# EAGLE design clock_rev0 (EAGLE 8.2.0)
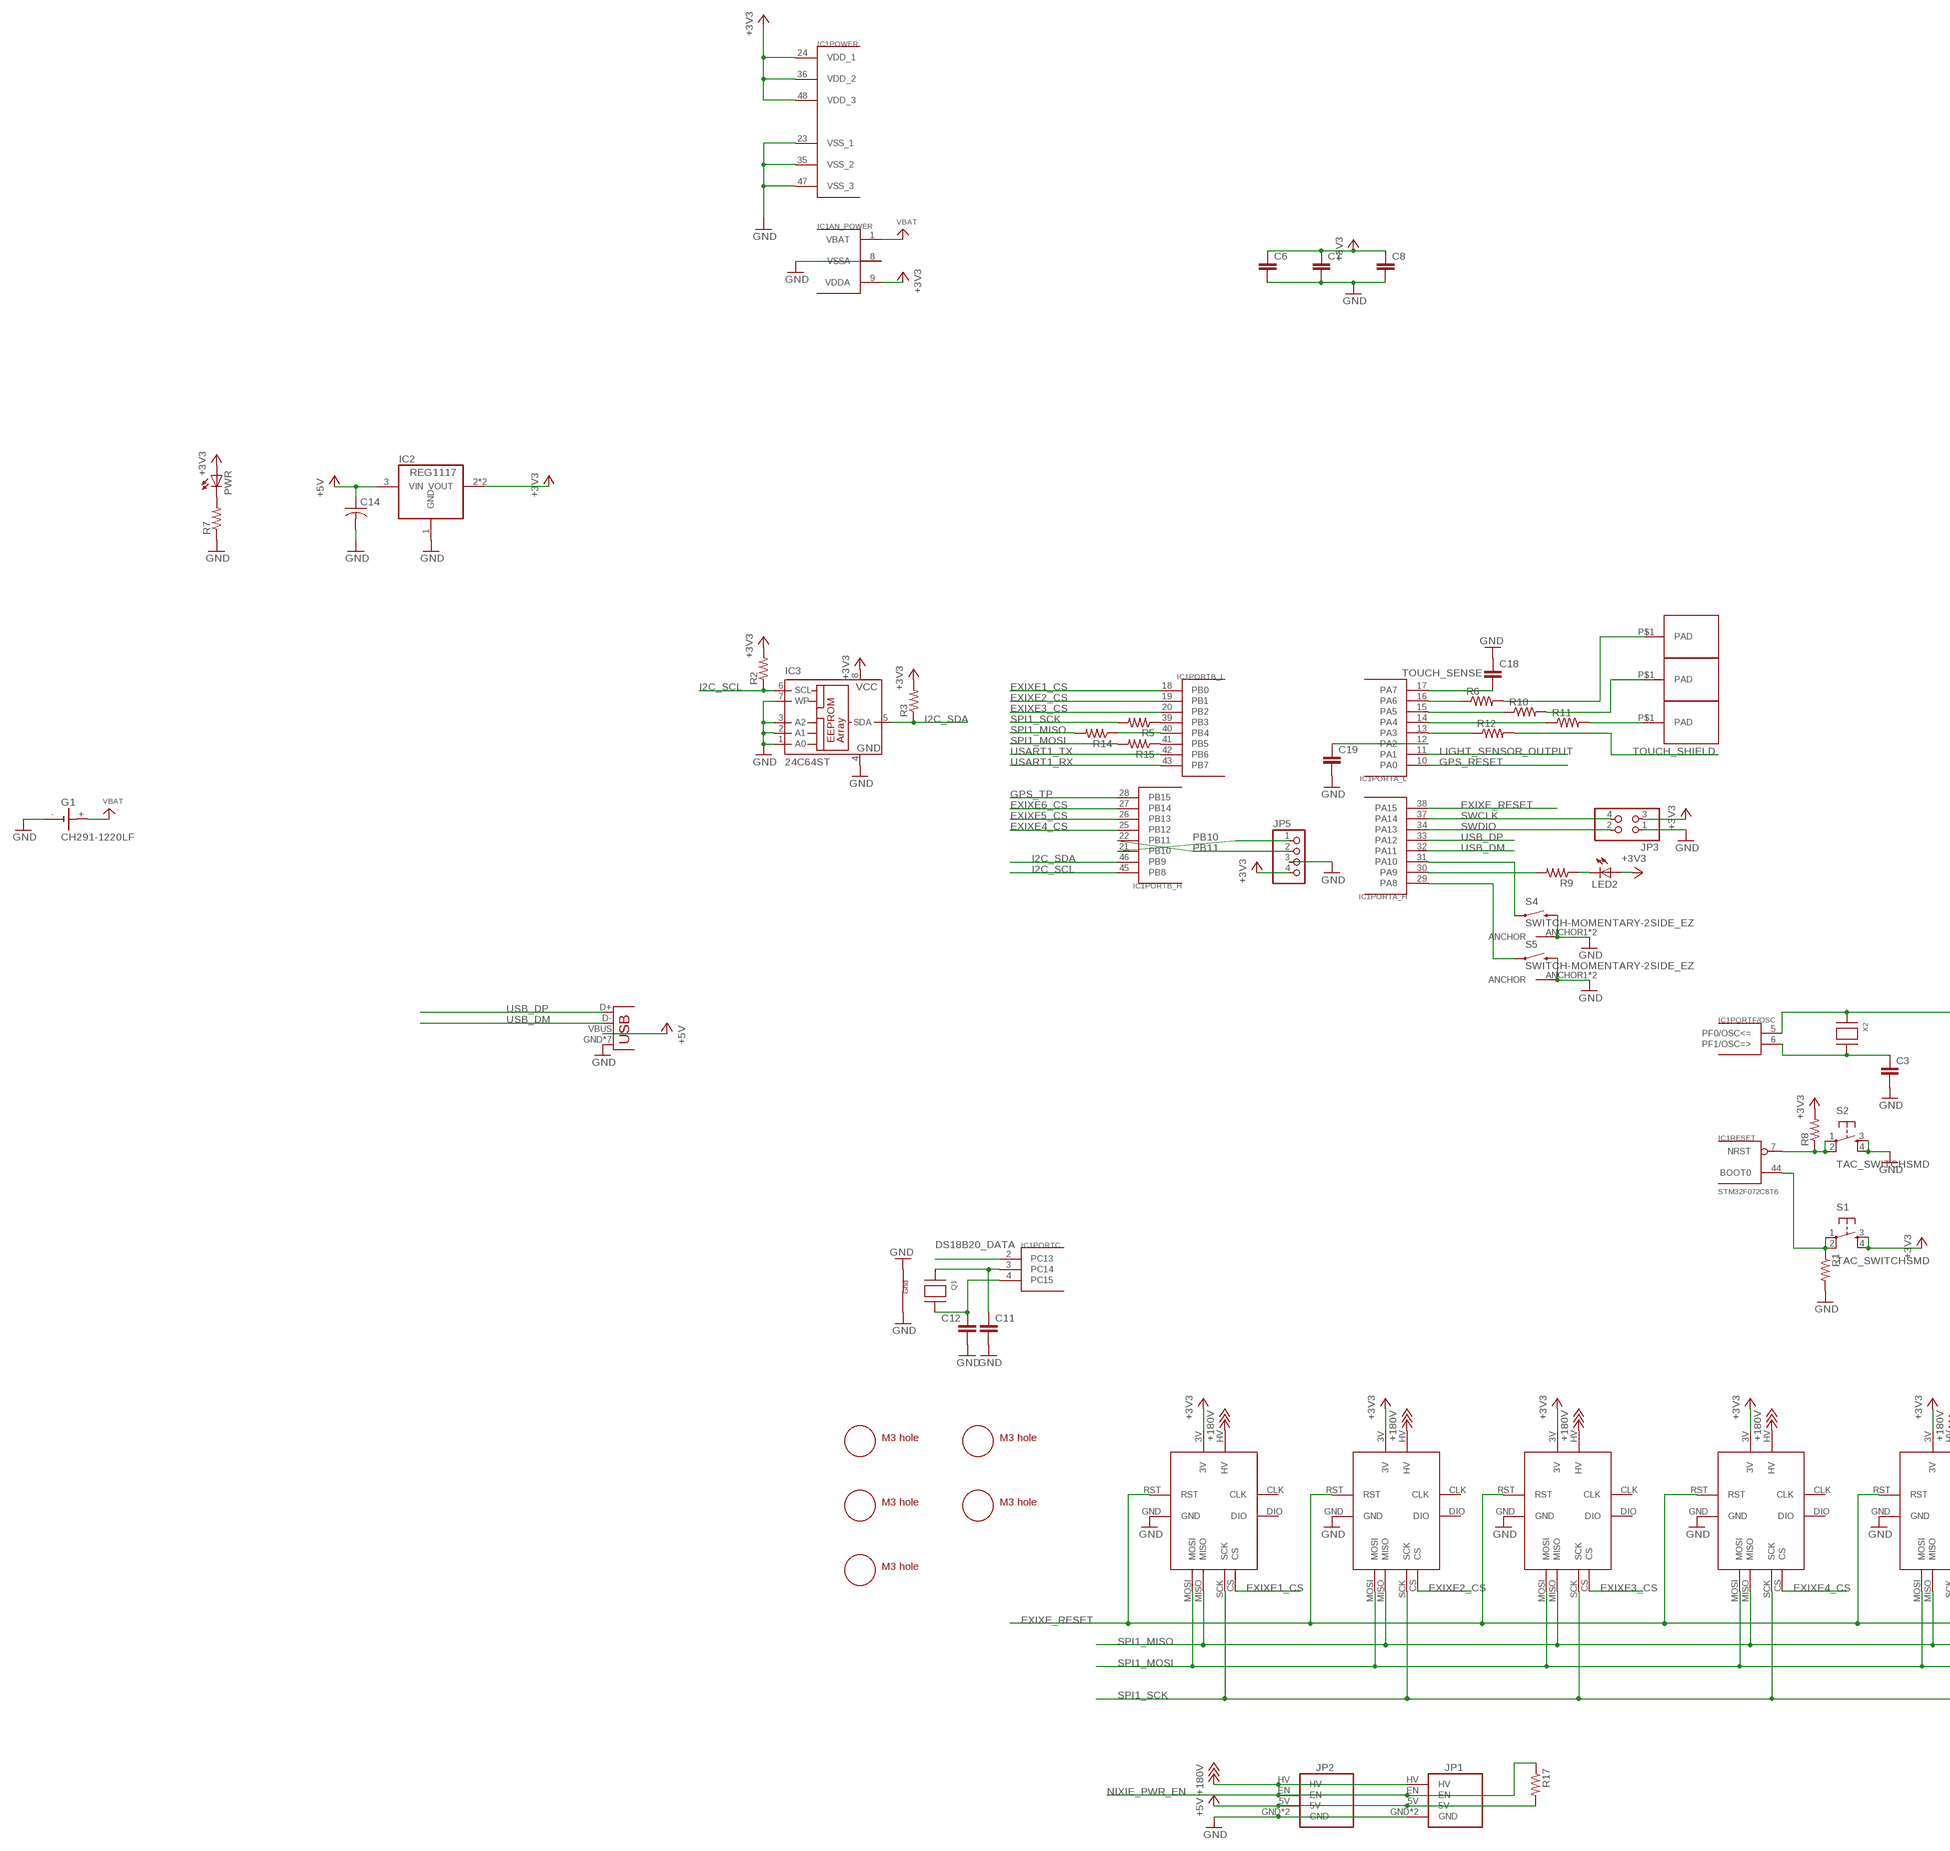
[diagram p0: schematic, sheet 1, part 1 of 2]
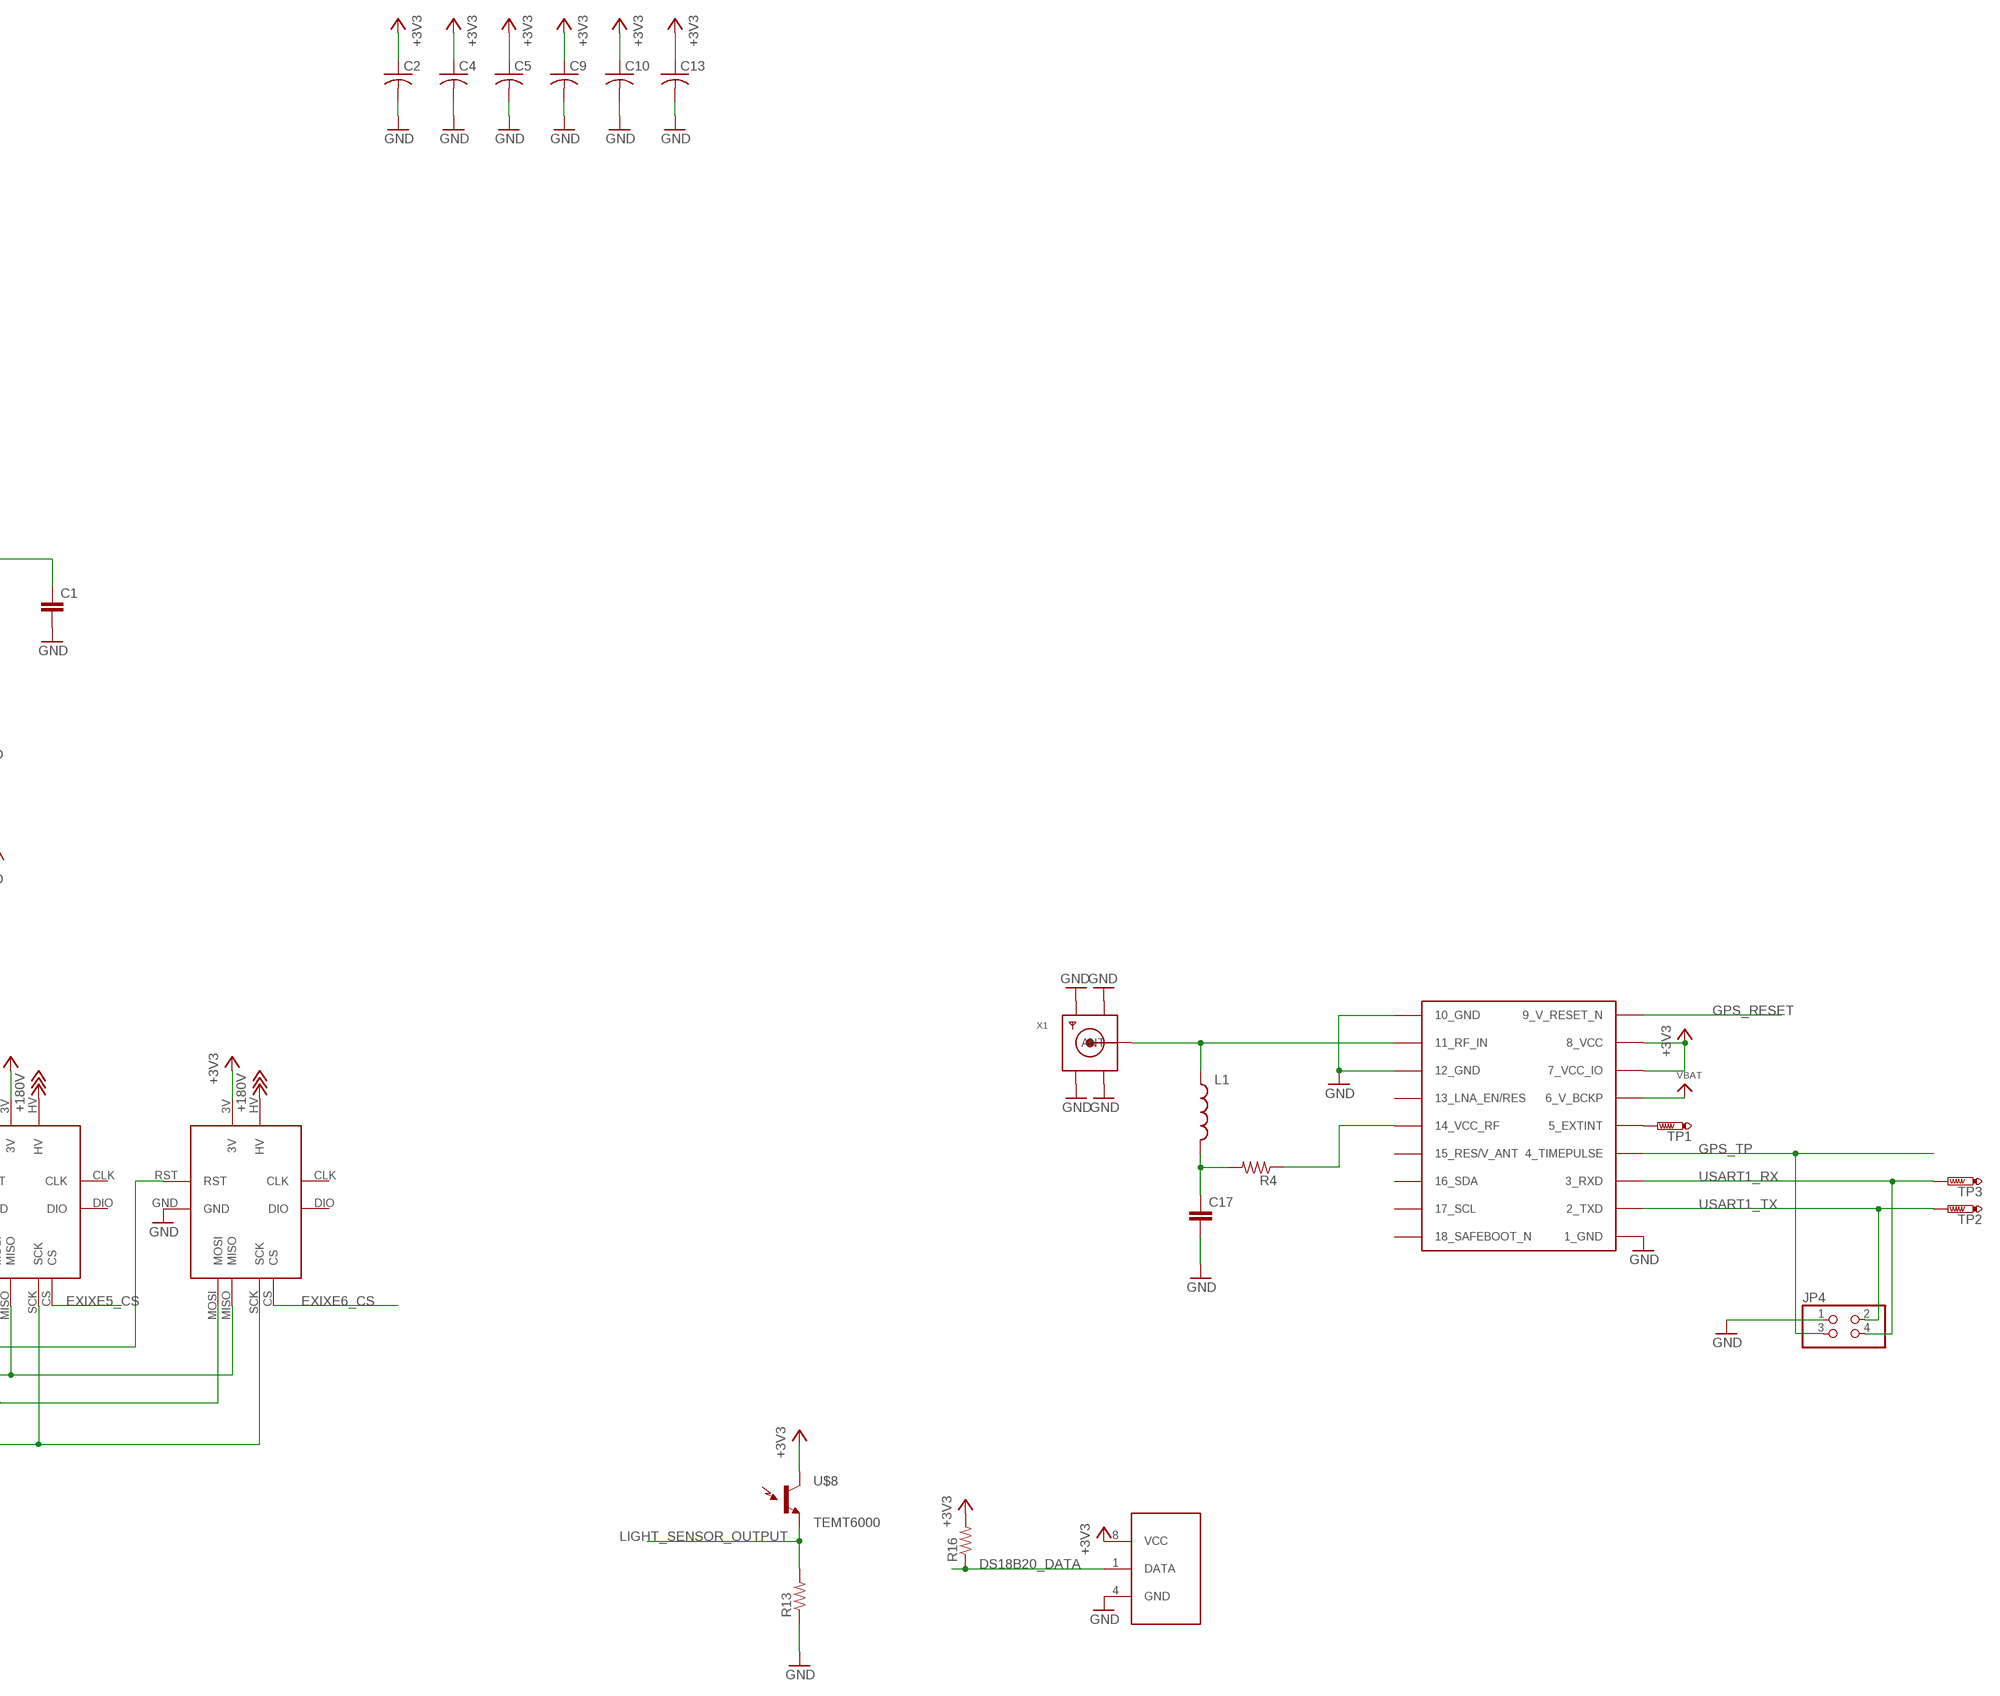
[diagram p1: schematic, sheet 1, part 2 of 2]

## Parts
C1  CAP0805  [0805]
C2  C-USC1210  [C1210]
C3  CAP0805  [0805]
C4  C-USC1210  [C1210]
C5  C-USC1210  [C1210]
C6  CAP0805  [0805]
C7  CAP0805  [0805]
C8  CAP0805  [0805]
C9  C-USC1210  [C1210]
C10  C-USC1210  [C1210]
C11  CAP0805  [0805]
C12  CAP0805  [0805]
C13  C-USC1210  [C1210]
C14  C-USC1210  [C1210]
C17  CAP0805  [0805]
C18  CAP0805  [0805]
C19  CAP0805  [0805]
G1  CH291-1220LF  [CH291-1220LF]
IC1  STM32F072C8T6  [TQFP48]
IC2  REG1117  [SOT223]
IC3  24C64ST  [TSSOP8]
JP1  EBAY_MODULEEBAY  [EBAY_PKG]
JP2  EBAY_MODULETAOBAO  [TAOBAO_PKG]
JP3  PINHD-2X2  [2X02]
JP4  PINHD-2X2  [2X02]
JP5  PINHD-1X4  [1X04]
L1  INDUCTOR0805  [0805]
LED2  LEDCHIP-LED0805  [CHIP-LED0805]
PWR  LEDCHIP-LED0805  [CHIP-LED0805]
Q1  XTAL-4-3225  [NX3225]
R1  RESISTOR0805-RES  [0805]
R2  RESISTOR0805-RES  [0805]
R3  RESISTOR0805-RES  [0805]
R4  RESISTOR0805-RES  [0805]
R5  RESISTOR0805-RES  [0805]
R6  RESISTOR0805-RES  [0805]
R7  RESISTOR0805-RES  [0805]
R8  RESISTOR0805-RES  [0805]
R9  RESISTOR0805-RES  [0805]
R10  RESISTOR0805-RES  [0805]
R11  RESISTOR0805-RES  [0805]
R12  RESISTOR0805-RES  [0805]
R13  RESISTOR0805-RES  [0805]
R14  RESISTOR0805-RES  [0805]
R15  RESISTOR0805-RES  [0805]
R16  RESISTOR0805-RES  [0805]
R17  RESISTOR0805-RES  [0805]
S1  TAC_SWITCHSMD  [TACTILE-SWITCH-SMD]
S2  TAC_SWITCHSMD  [TACTILE-SWITCH-SMD]
S4  SWITCH-MOMENTARY-2SIDE_EZ  [TACTILE-PTH-SIDEEZ]
S5  SWITCH-MOMENTARY-2SIDE_EZ  [TACTILE-PTH-SIDEEZ]
TP1  PTR1TP20R  [TP20R]
TP2  PTR1TP20R  [TP20R]
TP3  PTR1TP20R  [TP20R]
U$1  EXIXE  [EXIXE_PAC]
U$2  EXIXE  [EXIXE_PAC]
U$3  EXIXE  [EXIXE_PAC]
U$4  EXIXE  [EXIXE_PAC]
U$5  EXIXE  [EXIXE_PAC]
U$6  EXIXE  [EXIXE_PAC]
U$7  MAX-M8  [MAX-M8]
U$8  TEMT6000  [TEMT6000-SEN]
U$9  DS18B20  [MSOP8]
U$10  M3_MOUNTING_HOLE  [M3_MOUNTING_HOLE_PACK]
U$11  M3_MOUNTING_HOLE  [M3_MOUNTING_HOLE_PACK]
U$12  M3_MOUNTING_HOLE  [M3_MOUNTING_HOLE_PACK]
U$13  M3_MOUNTING_HOLE  [M3_MOUNTING_HOLE_PACK]
U$14  TOUCHPAD  [TOUCHPAD_PAK]
U$15  TOUCHPAD  [TOUCHPAD_PAK]
U$16  TOUCHPAD  [TOUCHPAD_PAK]
U$20  M3_MOUNTING_HOLE  [M3_MOUNTING_HOLE_PACK]
X1  SMACONNECTOR  [SMA90_DIP]
X2  XTAL-3.2X1.5  [XTAL3215]
X3  USB-MICROB  [USB-MICROB]

## Nets
+3V3: C2.1 C4.1 C5.1 C6.1 C7.1 C8.1 C9.1 C10.1 C13.1 IC1.9(AN_POWER:VDDA) IC1.24(POWER:VDD_1) IC1.36(POWER:VDD_2) IC1.48(POWER:VDD_3) IC2.2(VOUT) IC2.4(VOUT) IC3.8(VCC) JP3.3 JP5.4 LED2.A PWR.A R2.2 R3.2 R8.2 R16.2 S1.3 S1.4 U$1.3V U$2.3V U$3.3V U$4.3V U$5.3V U$6.3V U$7.7_VCC_IO U$7.8_VCC U$8.COLLECTOR(C1) U$9.8(VCC)
+5V: C14.1 IC2.3(VIN) JP1.5V JP2.5V R17.2 X3.VBUS
+180V: JP1.HV JP2.HV U$1.HV U$2.HV U$3.HV U$4.HV U$5.HV U$6.HV
DS18B20_DATA: IC1.2(PORTC:PC13) R16.1 U$9.1(DATA)
EXIXE1_CS: IC1.18(PORTB_L:PB0) U$1.CS
EXIXE2_CS: IC1.19(PORTB_L:PB1) U$2.CS
EXIXE3_CS: IC1.20(PORTB_L:PB2) U$3.CS
EXIXE4_CS: IC1.25(PORTB_H:PB12) U$4.CS
EXIXE5_CS: IC1.26(PORTB_H:PB13) U$5.CS
EXIXE6_CS: IC1.27(PORTB_H:PB14) U$6.CS
EXIXE_RESET: IC1.38(PORTA_H:PA15) U$1.RST U$2.RST U$3.RST U$4.RST U$5.RST U$6.RST
GND: C1.2 C2.2 C3.2 C4.2 C5.2 C6.2 C7.2 C8.2 C9.2 C10.2 C11.2 C12.2 C13.2 C14.2 C17.2 C18.1 C19.2 G1.- IC1.8(AN_POWER:VSSA) IC1.23(POWER:VSS_1) IC1.35(POWER:VSS_2) IC1.47(POWER:VSS_3) IC2.1(GND) IC3.1(A0) IC3.2(A1) IC3.3(A2) IC3.4(GND) IC3.7(WP) JP1.GND JP1.GND2(GND) JP2.GND JP2.GND2(GND) JP3.1 JP4.1 JP5.3 Q1.2(G2) Q1.4(G1) R1.2 R7.1 R13.1 S2.3 S2.4 S4.2 S4.ANCHOR1(ANCHOR) S4.ANCHOR2(ANCHOR) S5.2 S5.ANCHOR1(ANCHOR) S5.ANCHOR2(ANCHOR) U$1.GND U$2.GND U$3.GND U$4.GND U$5.GND U$6.GND U$7.1_GND U$7.10_GND U$7.12_GND U$9.4(GND) X1.GND1 X1.GND2 X1.GND3 X1.GND4 X3.GND X3.P1(GND) X3.P2(GND) X3.P3(GND) X3.P4(GND) X3.P5(GND) X3.P6(GND)
GPS_RESET: IC1.10(PORTA_L:PA0) U$7.9_RESET_N(9_V_RESET_N)
GPS_TP: IC1.28(PORTB_H:PB15) JP4.3 U$7.4_TIMEPULSE
I2C_SCL: IC1.45(PORTB_H:PB8) IC3.6(SCL) R2.1
I2C_SDA: IC1.46(PORTB_H:PB9) IC3.5(SDA) R3.1
LIGHT_SENSOR_OUTPUT: IC1.11(PORTA_L:PA1) R13.2 U$8.EMITTER(E1)
N$1: C11.1 IC1.3(PORTC:PC14) Q1.1(X1)
N$2: C12.1 IC1.4(PORTC:PC15) Q1.3(X2)
N$3: IC1.7(RESET:NRST) R8.1 S2.1 S2.2
N$4: L1.1 U$7.11_RF_IN X1.ANTENNA(ANT)
N$5: IC1.44(RESET:BOOT0) R1.1 S1.1 S1.2
N$6: C3.1 IC1.6(PORTF/OSC:PF1/OSC=>) X2.P$2
N$7: C1.1 IC1.5(PORTF/OSC:PF0/OSC<=) X2.P$1
N$8: IC1.14(PORTA_L:PA4) R11.1
N$9: R10.2 U$15.P$1(PAD)
N$10: R6.2 U$16.P$1(PAD)
N$11: IC1.13(PORTA_L:PA3) R12.1
N$12: C17.1 L1.2 R4.2
N$13: R4.1 U$7.14_VCC_RF
N$14: R11.2 U$14.P$1(PAD)
N$15: IC1.15(PORTA_L:PA5) R10.1
N$16: IC1.16(PORTA_L:PA6) R6.1
N$17: IC1.39(PORTB_L:PB3) R5.1
N$18: C19.1 IC1.12(PORTA_L:PA2)
N$19: IC1.41(PORTB_L:PB5) R15.1
N$20: IC1.40(PORTB_L:PB4) R14.1
N$21: LED2.C R9.1
N$22: IC1.31(PORTA_H:PA10) S4.1
N$23: IC1.29(PORTA_H:PA8) S5.1
N$24: IC1.30(PORTA_H:PA9) R9.2
N$25: TP1.TP U$7.5_EXTINT
N$27: PWR.C R7.2
NIXIE_PWR_EN: JP1.EN JP2.EN R17.1
PB10: IC1.21(PORTB_H:PB10) JP5.1
PB11: IC1.22(PORTB_H:PB11) JP5.2
SPI1_MISO: R14.2 U$1.MISO U$2.MISO U$3.MISO U$4.MISO U$5.MISO U$6.MISO
SPI1_MOSI: R15.2 U$1.MOSI U$2.MOSI U$3.MOSI U$4.MOSI U$5.MOSI U$6.MOSI
SPI1_SCK: R5.2 U$1.SCK U$2.SCK U$3.SCK U$4.SCK U$5.SCK U$6.SCK
SWCLK: IC1.37(PORTA_H:PA14) JP3.4
SWDIO: IC1.34(PORTA_H:PA13) JP3.2
TOUCH_SENSE: C18.2 IC1.17(PORTA_L:PA7)
TOUCH_SHIELD: R12.2
USART1_RX: IC1.43(PORTB_L:PB7) JP4.4 TP3.TP U$7.3_RXD
USART1_TX: IC1.42(PORTB_L:PB6) JP4.2 TP2.TP U$7.2_TXD
USB_DM: IC1.32(PORTA_H:PA11) X3.D-
USB_DP: IC1.33(PORTA_H:PA12) X3.D+
VBAT: G1.+ IC1.1(AN_POWER:VBAT) U$7.6_V_BCKP
Unconnected: U$1.CLK U$1.DIO U$2.CLK U$2.DIO U$3.CLK U$3.DIO U$4.CLK U$4.DIO U$5.CLK U$5.DIO U$6.CLK U$6.DIO U$7.13_LNA_EN(13_LNA_EN/RES) U$7.15_V_ANT/RESERVED(15_RES/V_ANT) U$7.16_SDA U$7.17_SCL U$7.18_SAFEBOOT_N

## Library data of the parts
C1 C3 C6-C8 C11 C12 C17-C19 = clock:CAP: Capacitor Standard 0603 ceramic capacitor, and 0.1" leaded capacitor.
C2 C4 C5 C9 C10 C13 C14 = clock:C-US: CAPACITOR, American symbol
G1 = basicBoard:CH291-1220LF: Battery Holder, SMT, 12mm multicomp PART NO. CH291-1220LF Source: Data sheet <http://www.farnell.com/datasheets/1505860.pdf>
IC1 = joyAnalog:STM32F072C8T6: ST STM32F072 48pin LQFP
IC2 = clock:REG1117: 800mA and 1A Low Dropout (LDO) Positive Regulator 1.8V, 2.5V, 2.85V, 3.3V, 5V, and Adj; MPN: REG1117; OC_FARNELL: 1097566; OC_NEWARK: 14P6981
IC3 = microchip:24*: Serial EEPROM I2C; MPN: CAT24C64YI-GT3; OC_FARNELL: 1718133; OC_NEWARK: 08R5418
JP1 JP2 = nixie_power:EBAY_MODULE: PIN HEADER
JP3 JP4 = pinhead:PINHD-2X2: PIN HEADER
JP5 = pinhead:PINHD-1X4: PIN HEADER
L1 = basicBoard:INDUCTOR: Inductors Basic Inductor/Choke - 0603 and 1206. Footprints are not proven and vary greatly between part numbers. INDUCTOR POWER 3.3UH 4.0A SMD 0.197" L x 0.197" W x 0.177" H (5.00mm x 5.00mm x 4.50mm)
LED2 PWR = backplane:LED: LED OSRAM: - CHIPLED LG R971, LG N971, LY N971, LG Q971, LY Q971, LO R971, LY R971 LH N974, LH R974 LS Q976, LO Q976, LY Q976 LO Q996 - Hyper CHIPLED LW Q18S LB Q993, LB Q99A, LB R99A - SideLED LS A670, LO A670, LY A670, LG A670, LP A670 LB A673, LV A673, LT A673, LW A673 LH A674 LY A675 LS A676, LA A676, LO A676, LY A676, LW A676 LS A679, LY A679, LG A679 - Hyper Micro SIDELED® LS Y876, LA Y876, LO Y876, LY Y876 LT Y87S - SmartLED LW L88C, LW L88S LB L89C, LB L89S, LG L890 LS L89K, LO L89K, LY L89K LS L896, LA L896, LO L896, LY L896 - TOPLED LS T670, LO T670, LY T670, LG T670, LP T670 LSG T670, LSP T670, LSY T670, LOP T670, LYG T670 LG T671, LOG T671, LSG T671 LB T673, LV T673, LT T673, LW T673 LH T674 LS T676, LA T676, LO T676, LY T676, LB T676, LH T676, LSB T676, LW T676 LB T67C, LV T67C, LT T67C, LS T67K, LO T67K, LY T67K, LW E67C LS E67B, LA E67B, LO E67B, LY E67B, LB E67C, LV E67C, LT E67C LW T67C LS T679, LY T679, LG T679 LS T770, LO T770, LY T770, LG T770, LP T770 LB T773, LV T773, LT T773, LW T773 LH T774 LS E675, LA E675, LY E675, LS T675 LS T776, LA T776, LO T776, LY T776, LB T776 LHGB T686 LT T68C, LB T68C - Hyper Mini TOPLED® LB M676 - Mini TOPLED Santana® LG M470 LS M47K, LO M47K, LY M47K Source: http://www.osram.convergy.de/
Q1 = adafruit:XTAL-4: Classic 4-pin 3.2 x 2.5mm crystal
R1-R17 = clock:RESISTOR: Resistor Basic schematic elements and footprints for 0603, 1206, and PTH resistors.
S1 S2 = SparkFun-Retired:TAC_SWITCH: Momentary Switch Button commonly used for reset or general input. Spark Fun Electronics SKU : COM-00097 SMT- SWCH-08247; PROD_ID: SWCH-08247
S4 S5 = bus:SWITCH-MOMENTARY-2: Various NO switches- pushbuttons, reed, etc
TP1-TP3 = testpad:PTR1: TEST PIN
U$1-U$6 = exixe_module:EXIXE
U$7 = ubloxLib:MAX-M8: u-blox MAX GNSS module
U$8 = ProtoSnap-v14a:TEMT6000: Ambient Light Sensor Simple light detection sensor. Output varies with light intensity input. Spark Fun Electronics SKU : COM-08348
U$9 = DS18B20U:DS18B20
U$10-U$13 U$20 = a:M3_MOUNTING_HOLE
U$14-U$16 = touch_pad:TOUCHPAD
X1 = clock:SMACONNECTOR: SMA Connector 90° DIP SMA Connector, 50 Ohm (4UConnector: 07259)
X2 = adafruit:XTAL: Low cost SMT crystals, no capacitors included http://www.ladyada.net/library/eagle
X3 = basicBoard:USB: USB Connectors USB-B-PTH is fully proven SKU : PRT-00139/CONN-08278 USB-miniB is fully proven SKU : PRT-00587 USB-A-PCB is untested. USB-A-H is throughly reviewed, but untested. Spark Fun Electronics SKU : PRT-00437 USB-B-SMT is throughly reviewed, but untested. Needs silkscreen touching up. USB-A-S has not been used/tested USB-MB-H has not been used/tested USB-MICROB has been used. CONN-09505; PROD_ID: CONN-09505

## Board
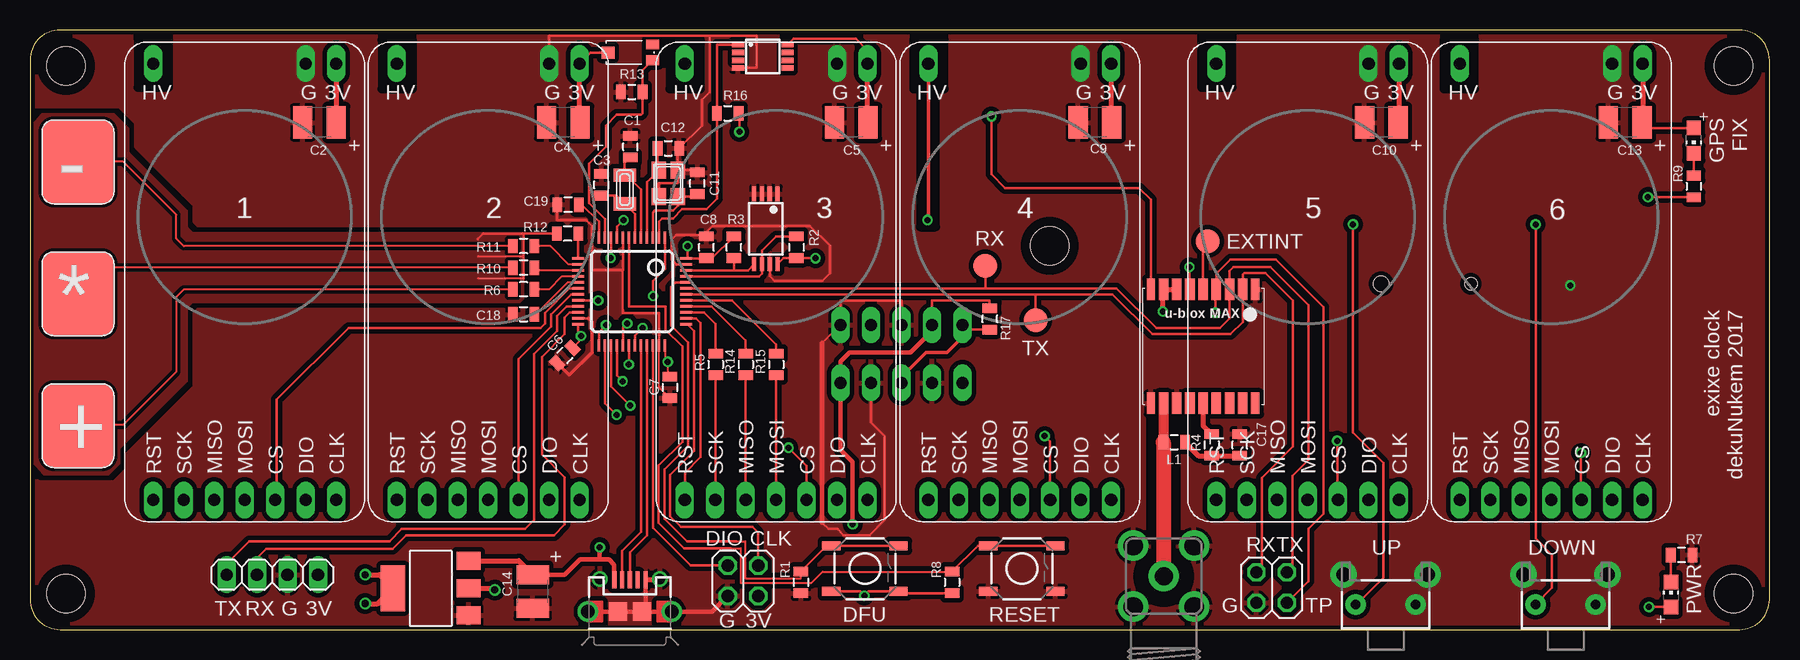
[diagram p2: board, top side]
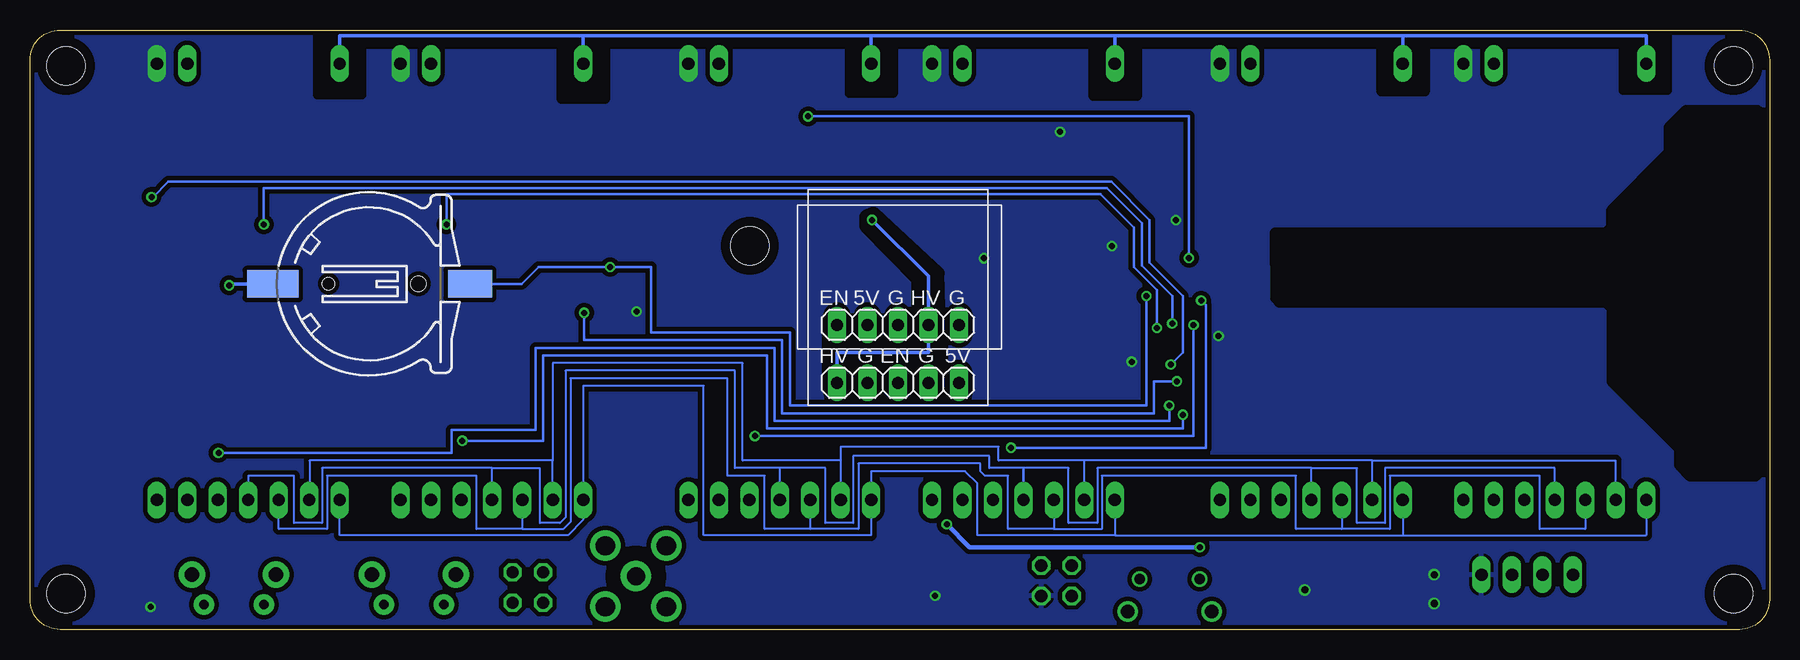
[diagram p3: board, bottom side, seen from below]

Size 145 x 50 mm. Coordinates in mm from the lower left corner, seen from the top.
Outline: 0,47.5 0,2.5 arc90 2.5,0 142.5,0 arc90 145,2.5 145,47.5 arc90 142.5,50 2.5,50 arc90 0,47.5
Copper layers (1*16): Top 0.035mm / dielectric 1.5mm / Bottom 0.035mm
Design rules "SparkFun-2-layer-TIGHT *": minimum track width 6mil, minimum drill 15mil, track to track 7mil, track to pad 7mil, pad to pad 7mil, via to via 7mil, smd to smd 7mil, copper to edge 7mil, drill to drill 7mil, minimum pad ring 4mil, minimum via ring 7mil, stop-mask expansion 4mil, vias tented up to drill 25mil, thermal gap 10mil
tRestrict: area 93.4,7.5 to 95.6,17.7; area 9,45.2 to 11.6,49.3; area 29.3,45.1 to 31.9,49.1; area 53.3,45.1 to 55.9,49.1; area 73.7,45.1 to 76.2,49.1; area 97.7,45.2 to 100.2,49.3; area 117.9,45.1 to 120.4,49.1; area 74.2,33.6 to 75.5,45.3
bRestrict: area 0.2,12.8 to 41.2,43.3; area 68.8,20.2 to 78.6,25.8; area 9,48.8 to 120.5,52.1; area 8.5,45 to 12.2,50.3; area 28.7,44.8 to 32.4,50.2; area 52.7,44.5 to 56.4,49.8; area 97,44.2 to 100.7,49.5; area 117.3,44.6 to 121,49.9; area 69.2,24.9 to 75.3,34.7; area 73,44.7 to 76.7,50

### Footprints (pad centres in the part's own frame; a part is rotated, then mirrored left to right if it is on the bottom)
0805 = smd 0.8 x 1.2: 1 -0.9,0; 2 0.9,0
C1210 = smd 1.6 x 2.7: 1 -1.4,0; 2 1.4,0
CH291-1220LF = smd 2.3 x 3.66: + 0,-2.296 | smd 2.3 x 4.3: - 0,14.146 | hole 1.3: 0,2 | hole 1: 0,9.5
TQFP48 = smd 0.2 x 1: 1 -2.75,-4.5; 2 -2.25,-4.5; 3 -1.75,-4.5; 4 -1.25,-4.5; 5 -0.75,-4.5; 6 -0.25,-4.5; 7 0.25,-4.5; 8 0.75,-4.5; 9 1.25,-4.5; 10 1.75,-4.5; 11 2.25,-4.5; 12 2.75,-4.5; 25 2.75,4.5; 26 2.25,4.5; 27 1.75,4.5; 28 1.25,4.5; 29 0.75,4.5; 30 0.25,4.5; 31 -0.25,4.5; 32 -0.75,4.5; 33 -1.25,4.5; 34 -1.75,4.5; 35 -2.25,4.5; 36 -2.75,4.5 | smd 1 x 0.2: 13 4.5,-2.75; 14 4.5,-2.25; 15 4.5,-1.75; 16 4.5,-1.25; 17 4.5,-0.75; 18 4.5,-0.25; 19 4.5,0.25; 20 4.5,0.75; 21 4.5,1.25; 22 4.5,1.75; 23 4.5,2.25; 24 4.5,2.75; 37 -4.5,2.75; 38 -4.5,2.25; 39 -4.5,1.75; 40 -4.5,1.25; 41 -4.5,0.75; 42 -4.5,0.25; 43 -4.5,-0.25; 44 -4.5,-0.75; 45 -4.5,-1.25; 46 -4.5,-1.75; 47 -4.5,-2.25; 48 -4.5,-2.75
SOT223 = smd 1.499 x 2.007: 1 -2.261,-3.15; 2 0.025,-3.15; 3 2.311,-3.15 | smd 3.81 x 2.007: 4 0,3.15
TSSOP8 = smd 0.35 x 1.2: 1 -0.975,-2.925; 2 -0.325,-2.925; 3 0.325,-2.925; 4 0.975,-2.925; 5 0.975,2.925; 6 0.325,2.925; 7 -0.325,2.925; 8 -0.975,2.925
EBAY_PKG = drill 1.016 long: 5V 2.54,0; EN 5.08,0; GND 0,0; GND2 -5.08,0; HV -2.54,0
TAOBAO_PKG = drill 1.016 long: 5V -5.08,0; EN 0,0; GND 2.54,0; GND2 -2.54,0; HV 5.08,0
2X02 = drill 1.016 octagon: 1 -1.27,-1.27; 2 -1.27,1.27; 3 1.27,-1.27; 4 1.27,1.27
1X04 = drill 1.016 long: 1 -3.81,0; 2 -1.27,0; 3 1.27,0; 4 3.81,0
CHIP-LED0805 = smd 1.2 x 1.2: A 0,-1.05; C 0,1.05
NX3225 = smd 1.4 x 1.2: 1 -1.1,-0.8; 2 1.1,-0.8; 3 1.1,0.8; 4 -1.1,0.8
TACTILE-SWITCH-SMD = smd 1.524 x 0.762: 1 -2.794,1.905; 2 2.794,1.905; 3 -2.794,-1.905; 4 2.794,-1.905
TACTILE-PTH-SIDEEZ = drill 0.8 pad 1.7: 1 -2.5,0; 2 2.5,0 | drill 1.2 pad 2.2: ANCHOR1 -3.5,2.5; ANCHOR2 3.5,2.5
TP20R = smd 2 x 2: TP 0,0
EXIXE_PAC = drill 1.016 long: 3V 17.62,38.2; CLK 17.62,1.8; CS 12.54,1.8; DIO 15.08,1.8; GND 15.08,38.2; HV 2.38,38.2; MISO 7.46,1.8; MOSI 10,1.8; RST 2.38,1.8; SCK 4.92,1.8
MAX-M8 = smd 1.8 x 0.7: 1_GND 4.95,-4.4; 9_RESET_N 4.95,4.3; 10_GND -4.55,4.3; 18_SAFEBOOT_N -4.55,-4.4 | smd 1.8 x 0.8: 2_TXD 4.95,-3.35; 3_RXD 4.95,-2.25; 4_TIMEPULSE 4.95,-1.15; 5_EXTINT 4.95,-0.05; 6_V_BCKP 4.95,1.05; 7_VCC_IO 4.95,2.15; 8_VCC 4.95,3.25; 11_RF_IN -4.55,3.25; 12_GND -4.55,2.15; 13_LNA_EN -4.55,1.05; 14_VCC_RF -4.55,-0.05; 15_V_ANT/RESERVED -4.55,-1.15; 16_SDA -4.55,-2.25; 17_SCL -4.55,-3.35
TEMT6000-SEN = smd 1.1 x 0.8: BASE -1.87,-0.65; EMITTER -1.87,0.65 | smd 1.1 x 1: COLLECTOR 1.86,0.01
MSOP8 = smd 0.45 x 1: 1 -0.975,-2.05; 2 -0.325,-2.05; 3 0.325,-2.05; 4 0.975,-2.05; 5 0.975,2.05; 6 0.325,2.05; 7 -0.325,2.05; 8 -0.975,2.05
M3_MOUNTING_HOLE_PACK = hole 3.2: 0,0
TOUCHPAD_PAK = smd 6 x 7: P$1 0,0
SMA90_DIP = drill 1.5 pad 2.54: ANTENNA 0,0 | drill 1.6 pad 2.54: GND1 -2.54,2.54; GND2 2.54,2.54; GND3 -2.54,-2.54; GND4 2.54,-2.54
XTAL3215 = smd 1.1 x 1.9: P$1 1.2,0; P$2 -1.2,0
USB-MICROB = smd 0.35 x 1.4: D+ 0,2.65; D- -0.65,2.65; GND 1.3,2.65; ID 0.65,2.65; VBUS -1.3,2.65 | smd 1.5 x 1.55: P1 -1,0; P2 1,0 | drill 1.15 pad 1.422: P3 -3.5,0; P4 3.5,0 | drill 0.85 pad 1.27: P5 -2.5,2.7; P6 2.5,2.7

### Placement (x,y rotation side)
C1  50.04,40.26 90 top
C2  24.13,42.29 180 top
C3  47.62,37.08 90 top
C4  44.45,42.29 180 top
C5  68.45,42.29 180 top
C6  44.58,22.86 225 top
C7  53.34,20.19 270 top
C8  56.39,31.88 90 top
C9  88.77,42.29 180 top
C10  112.65,42.29 180 top
C11  55.63,37.21 90 top
C12  53.21,40.13 0 top
C13  132.97,42.29 180 top
C14  41.91,3.17 270 top
C17  100.84,15.39 90 top
C18  41.15,26.29 0 top
C19  44.86,35.43 180 top
G1  110.62,28.83 90 bottom
IC1  50.18,28.2 180 top
IC2  33.4,3.43 90 top
IC3  61.34,33.4 180 top
JP1  72.64,25.4 180 bottom
JP2  72.64,20.57 180 bottom
JP3  59.44,4.06 0 top
JP4  103.5,3.5 0 top
JP5  20.19,4.57 0 top
L1  95.38,15.62 0 top
LED2  138.68,40.77 180 top
PWR  136.78,2.92 0 top
Q1  53.21,37.21 90 top
R1  64.26,3.94 270 top
R2  63.88,31.88 270 top
R3  58.67,31.88 90 top
R4  98.5,15.39 270 top
R5  57.15,22.1 270 top
R6  41.15,28.37 180 top
R7  137.67,6.22 180 top
R8  76.86,3.94 270 top
R9  138.68,36.96 270 top
R10  41.15,30.18 180 top
R11  41.15,31.98 180 top
R12  44.81,33.02 180 top
R13  50.16,44.83 0 top
R14  59.66,22.1 270 top
R15  62.2,22.1 270 top
R16  58.17,43.05 0 top
R17  80.01,25.91 90 top
S1  69.6,5.08 0 top
S2  82.68,5.08 0 top
S4  113,2.1 0 top
S5  128,2.1 0 top
TP1  98.17,32.38 0 top
TP2  83.82,25.78 0 top
TP3  79.63,30.35 0 top
U$1  7.9,9 0 top
U$2  28.2,9 0 top
U$3  52.2,9 0 top
U$4  72.5,9 0 top
U$5  96.5,9 0 top
U$6  116.8,9 0 top
U$7  97.74,23.42 90 top
U$8  50.04,48.13 180 top
U$9  61.09,47.8 270 top
U$10  3,47 0 top
U$11  3,3 0 top
U$12  142,3 0 top
U$13  142,47 0 top
U$14  4,39 0 top
U$15  4,28 0 top
U$16  4,17 0 top
U$20  85,32 0 top
X1  94.5,4.45 180 top
X2  49.58,36.7 90 top
X3  50,1.5 0 top

### Tracks (layer width: path | path; a pad name or v marks a point on that pad's centre or on a via)
+3V3  (via drill 0.5, 0.6)
  Top 0.178: IC1.36 52.93,22.56 v53.16,22.33 53.16,21.27 C7.1
  Top 0.203: S1.3 69.19,3.17 v69.55,2.82 69.9,3.17 S1.4 72.53,3.04 R8.2 | 54.86,30.95 IC1.48 | 54.86,30.95 56.36,30.95 C8.1 56.87,30.98 R3.2 | v54.81,31.98 54.81,31 54.86,30.95 | v65.48,30.96 63.9,30.96 R2.2 62.82,30.98 IC3.8 | IC1.24 45.68,24.73 v45.92,24.49 45.92,24.21 C6.1 | U$2.3V 46.74,48.12 U$8.COLLECTOR | U$3.3V 69.82,48.29 68.83,49.28 63.64,49.28 U$9.8 | R16.2 59.13,42.99 v59.13,41.5 | v49.48,34.14 48.93,33.59 IC1.9 | v134.95,1.88 PWR.A | LED2.A 134.84,41.82 C13.1
  Top 0.406: U$1.3V 25.52,42.3 C2.1 | U$2.3V 45.82,42.32 C4.1 | U$3.3V 69.82,42.32 C5.1 | U$4.3V 90.12,42.34 C9.1 | U$5.3V 114.12,42.36 C10.1 | U$6.3V 134.42,42.34 C13.1 | v94.44,26.52 94.44,28.42 U$7.8_VCC U$7.7_VCC_IO | IC2.2 38.58,3.45 v38.73,3.3 | v27.94,4.57 29.11,4.57 IC2.4 28.98,2.16 v27.94,2.16
  pour Bottom (isolate 0.381): 145,0 0,0 0,50 145,50
+5V  (via drill 0.5)
  Top 0.203: JP1.5V 75.18,27.46 79.98,27.46 79.98,26.81 R17.2
  Top 0.356: JP1.5V 75.18,24.89 73.41,23.11 68.33,23.11 67.56,22.35 JP2.5V 67.56,14.99 68.58,13.97 v68.58,8.76 | C14.1 44.58,4.57 45.85,5.84 47.5,5.84 | X3.VBUS 48.7,5.4 48.26,5.84 47.5,5.84 | v47.5,6.86 47.5,5.84
  Top 0.406: C14.1 40.74,5.74 IC2.3
  Bottom 0.356: v47.5,6.86 66.67,6.86 v68.58,8.76
+180V  (via drill 0.5)
  Top 0.305: U$4.HV 74.88,34.24 v74.8,34.16
  Bottom 0.305: U$1.HV 10.28,49.51 30.58,49.51 | 54.58,49.51 30.58,49.51 | 74.88,49.51 54.58,49.51 | 98.88,49.51 74.88,49.51 | 98.88,49.51 119.18,49.51 U$6.HV | U$2.HV 30.58,49.51 | U$3.HV 54.58,49.51 | 74.88,49.51 U$4.HV | U$5.HV 98.88,49.51 | JP2.HV 77.72,23.11 70.1,23.11 JP1.HV 70.1,29.46 v74.8,34.16
DS18B20_DATA
  Top 0.203: U$9.1 57.28,48.77 57.28,43.06 R16.1 57.27,35.93 56.39,35.05 54.36,35.05 53.59,34.29 52.7,34.29 52.43,34.02 IC1.2
EXIXE1_CS
  Top 0.203: IC1.18 44.96,28.45 42.93,26.42 42.93,25.53 42.55,25.15 26.54,25.15 20.57,19.18 20.57,10.93 U$1.CS
EXIXE2_CS
  Top 0.203: IC1.19 45.09,27.95 43.43,26.29 43.43,25.27 40.74,22.58 U$2.CS
EXIXE3_CS  (via drill 0.5)
  Top 0.203: IC1.20 47.37,27.45 v47.37,27.43 | U$3.CS 64.74,13.64 v63.22,15.16
  Bottom 0.203: v47.37,27.43 46.99,27.05 46.99,15.16 v63.22,15.16
EXIXE4_CS  (via drill 0.5)
  Top 0.203: IC1.25 47.43,24.83 v48.01,25.4 | v84.58,16.13 85.04,15.67 U$4.CS
  Bottom 0.203: v48.01,25.4 48.01,24.13 48.01,16.13 v84.58,16.13
EXIXE5_CS  (via drill 0.5)
  Top 0.203: v108.97,15.75 108.97,10.8 U$5.CS | IC1.26 47.93,18.87 v48.9,17.91
  Bottom 0.203: v48.9,17.91 48.9,16.76 83.57,16.76 83.57,22.86 102.23,22.86 102.23,15.75 v108.97,15.75
EXIXE6_CS  (via drill 0.5)
  Top 0.203: v129.29,14.73 129.29,10.8 U$6.CS | IC1.27 48.43,20.27 v50.04,18.67
  Bottom 0.203: v50.04,18.67 50.04,17.4 82.93,17.4 82.93,23.5 102.87,23.5 102.87,16.64 109.86,16.64 109.86,14.73 v129.29,14.73
EXIXE_RESET
  Top 0.203: IC1.38 55.51,25.95 55.88,25.58 55.88,14.38 54.59,13.08 U$3.RST
  Bottom 0.178: U$1.RST 10.28,7.87 30.58,7.87 | 54.58,7.87 30.58,7.87 | U$6.RST 119.18,7.87 100.15,7.87 98.88,9.15 U$5.RST 98.88,20.32 88.85,20.32 88.85,7.87 74.88,7.87 U$4.RST 74.88,13.21 67.06,13.21 66.04,12.19 66.04,7.87 54.58,7.87 | U$2.RST 30.58,7.87 | U$3.RST 54.58,7.87
GND  (via drill 0.5)
  Top 0.178: IC1.35 52.43,20.2 C7.2
  Top 0.203: IC1.47 53.88,30.45 53.47,30.86 53.47,32.51 53.85,32.89 56.27,32.89 C8.2 56.39,33.15 56.9,33.66 65.02,33.66 66.67,32 66.67,29.72 66.04,29.08 62.05,29.08 61.67,29.46 IC3.7 | Q1.4 52.41,37.21 53.98,37.21 53.98,38.31 | 53.98,38.31 Q1.2 55.63,38.31 C11.2 | C19.2 43.96,34.16 46.35,34.16 46.86,33.66 46.86,29.97 49.4,29.97 | IC1.23 46.57,25.95 | 44.96,21.21 44.95,21.21 | U$2.GND 43.28,49.53 56.64,49.53 | U$9.4 59.04,46.86 60.58,46.86 60.58,49.53 56.64,49.53 | 53.98,38.31 53.98,39.99 C12.2 56.01,42.03 56.01,44.2 56.64,44.83 56.64,49.53 | 66.04,23.88 JP1.GND2 67.56,27.43 72.64,27.43 JP1.GND | 66.04,8.89 66.55,8.38 67.31,8.38 67.82,7.87 69.98,7.87 71.25,9.14 71.25,16.13 70.1,17.27 JP2.GND2 | IC1.8 49.43,29.97 49.4,29.97 | IC1.35 52.43,26.42 49.4,26.42 49.4,29.97
  Top 0.305: 46.57,25.95 46.86,25.65 46.86,23.11 44.96,21.21 | 44.95,21.21 C6.2
  Top 0.356: 66.04,8.89 66.04,23.88 | X3.P6 52.45,4.15 X3.GND 51.3,1.8 X3.P2 | X3.P2 X3.P1 X3.P3 | X3.P2 X3.P4 56.87,1.5 JP3.1
  Bottom 0.305: v128.4,28.7 128.27,28.83 G1.-
  pour Top (isolate 0.381, rank 6): 0,50 145,50 145,0 0,0
GPS_RESET  (via drill 0.5)
  Top 0.203: IC1.10 48.43,31.03 v48.39,30.99 | v80.14,42.8 80.14,37.97 81.28,36.83 92.46,36.83 93.44,35.85 U$7.9_RESET_N
  Bottom 0.203: v80.14,42.8 48.39,42.8 v48.39,30.99
GPS_TP  (via drill 0.5)
  Top 0.203: IC1.28 48.93,21.17 v49.4,20.7 | v98.81,26.42 98.81,28.29 U$7.4_TIMEPULSE 98.89,29.67 100.08,30.86 103.83,30.86 107.8,26.9 107.8,9.63 106.55,8.38 106.55,4.01 JP4.3
  Bottom 0.203: v49.4,20.7 51.31,20.7 51.31,18.03 82.3,18.03 82.3,24.13 98.81,24.13 v98.81,26.42
I2C_SCL
  Top 0.203: IC1.45 60.77,29.45 61.01,29.69 IC3.6 | IC3.6 | R2.1 62.19,32.78 61.01,31.6 IC3.6
I2C_SDA
  Top 0.203: 58.67,29.95 IC1.46 | 58.67,29.95 59.84,29.95 IC3.5 | R3.1 58.67,29.95
LIGHT_SENSOR_OUTPUT
  Top 0.203: IC1.11 47.93,34.24 46.61,35.56 46.61,38.86 48.01,40.26 48.01,42.04 48.9,42.93 50.93,42.93 51.05,43.05 R13.2 51.06,46.64 U$8.EMITTER
N$1
  Top 0.203: IC1.3 51.93,34.79 52.07,34.92 53.59,34.92 54.01,35.34 Q1.1 55.63,36.11 C11.1
N$2
  Top 0.203: IC1.4 51.43,37.33 Q1.3 52.31,38.31 C12.1
N$3
  Top 0.178: 58.4,6.78 59.23,6.78 59.23,3.89 65.13,3.89 66.06,4.83 76.85,4.83 R8.1
  Top 0.203: 58.45,6.78 58.4,6.78 54.51,6.78 52.4,8.89 52.4,13.68 54.38,15.66 54.38,23.6 52.98,24.99 52.96,24.99 52.96,26.92 50.55,26.92 49.93,26.92 IC1.7 | S2.2 S2.1 79.01,6.99 R8.1
N$4
  Top 0.762: 94.49,15.63 L1.1
  Top 0.813: U$7.11_RF_IN 94.49,15.63
  Top 1.27: L1.1 94.48,4.47 X1.ANTENNA
N$5
  Top 0.178: 58.88,7.37 59.61,7.37 59.61,4.27 64.26,4.27 R1.1
  Top 0.203: 58.88,7.37 54.76,7.37 52.88,9.25 52.88,13.34 54.86,15.32 54.86,23.93 53.44,25.35 53.44,28.57 53.81,28.95 IC1.44 | R1.1 66.41,6.99 S1.1 S1.2
N$6
  Top 0.203: IC1.6 50.43,34.65 X2.P$2 48.9,36.18 C3.1
N$7
  Top 0.203: IC1.5 50.93,36.68 49.71,37.9 X2.P$1 49.58,38.9 C1.1
N$8
  Top 0.152: IC1.14 44.91,30.45 43.38,31.98 R11.1
N$9
  Top 0.152: R10.2 6.17,30.18 U$15.P$1
N$10
  Top 0.152: U$16.P$1 4.07,17.07 7.77,17.07 12.19,21.49 12.19,27.74 12.83,28.37 R6.2
N$11
  Top 0.203: R12.1 45.71,30.97 IC1.13
N$12
  Top 0.406: L1.2 97.41,14.49 R4.2 C17.1
N$13
  Top 0.406: U$7.14_VCC_RF 97.79,17 R4.1
N$14
  Top 0.152: U$14.P$1 4.01,39.01 7.77,39.01 12.19,34.59 12.19,32.61 12.83,31.98 R11.2
N$15
  Top 0.152: IC1.15 42.27,29.95 R10.1
N$16
  Top 0.152: IC1.16 44.33,29.45 43.26,28.37 R6.1
N$17
  Top 0.203: IC1.39 56.18,26.45 57.15,25.48 R5.1
N$18
  Top 0.203: C19.1 46,35.43 47.42,34.01 IC1.12
N$19
  Top 0.203: IC1.41 58.53,27.45 62.2,23.77 R15.1
N$20
  Top 0.203: IC1.40 56.82,26.95 59.66,24.11 R14.1
N$21
  Top 0.203: R9.1 LED2.C
N$22  (via drill 0.5)
  Top 0.203: v110.29,33.78 110.29,16.43 112.83,13.89 112.83,4.33 110.6,2.1 S4.1 | IC1.31 50.43,24.52 v51.05,25.15
  Bottom 0.203: v110.29,33.78 110.29,36.32 55.75,36.32 52.96,33.53 52.96,30.23 51.05,28.32 v51.05,25.15
N$23  (via drill 0.5)
  Top 0.203: v125.5,33.78 125.5,7.59 126.87,6.22 126.87,3.47 S5.1 | IC1.29 49.43,25.18 v49.78,25.53
  Bottom 0.203: v125.5,33.78 125.5,36.83 55.24,36.83 52.32,33.91 52.32,30.35 49.78,27.81 v49.78,25.53
N$24  (via drill 0.5)
  Top 0.203: IC1.30 49.93,22.12 v49.91,22.1 | v134.87,36.07 R9.2
  Bottom 0.203: v49.91,22.1 48.9,23.11 48.9,27.81 51.69,30.61 51.69,34.16 54.86,37.34 133.48,37.34 134.75,36.07 v134.87,36.07
N$25
  Top 0.203: U$7.5_EXTINT 97.79,32 TP1.TP
N$27
  Top 0.203: PWR.C R7.2
NIXIE_PWR_EN
  Top 0.203: JP1.EN 77.72,25.01 R17.1
  Top 0.305: JP1.EN 77.72,24.38 76.45,23.11 74.68,23.11 72.64,21.08 JP2.EN
PB10
  Top 0.203: IC1.21 44.73,26.95 43.94,26.16 43.94,24.89 42.04,22.99 42.04,9.14 41.27,8.38 30.99,8.38 29.97,7.37 18.29,7.37 16.38,5.46 JP5.1
PB11
  Top 0.203: IC1.22 44.99,26.45 44.58,26.04 44.58,24.64 42.67,22.73 42.67,14.61 44.58,12.7 44.58,8.76 43.69,7.87 31.37,7.87 30.23,6.73 19.68,6.73 18.92,5.97 JP5.2
SPI1_MISO
  Top 0.203: R14.2 U$3.MISO
  Bottom 0.178: U$1.MISO 15.36,8.38 19.15,8.38 19.15,12.83 31.65,12.83 31.65,8.38 35.66,8.38 | U$6.MISO 124.26,8.38 120.24,8.38 120.24,12.83 107.77,12.83 107.77,8.38 103.96,8.38 | 79.96,8.38 75.95,8.38 75.95,13.84 65.79,13.84 65.79,13.21 65.41,12.83 63.48,12.83 63.48,8.38 59.66,8.38 | U$4.MISO 79.96,8.38 | 35.66,8.38 39.47,8.38 39.47,12.83 55.65,12.83 55.65,8.38 59.66,8.38 | 103.96,8.38 100.53,8.38 99.95,8.97 99.95,20.95 86.87,20.95 86.87,12.83 83.77,12.83 83.77,8.38 79.96,8.38 | U$2.MISO 35.66,8.38 | U$3.MISO 59.66,8.38 | U$5.MISO 103.96,8.38
SPI1_MOSI
  Top 0.203: R15.2 U$3.MOSI
  Bottom 0.178: U$1.MOSI 17.9,13.46 32.05,13.46 32.05,8.89 34.39,8.89 34.39,13.46 38.2,13.46 | 38.2,13.46 56.03,13.46 56.03,8.89 58.42,8.89 58.42,13.46 62.23,13.46 65.02,13.46 65.02,14.48 76.38,14.48 76.38,8.89 78.69,8.89 78.69,13.46 82.5,13.46 | 106.5,13.46 102.49,13.46 102.49,8.89 100.81,8.89 100.36,9.35 100.36,21.59 86.23,21.59 86.23,13.46 82.5,13.46 | 106.5,13.46 120.65,13.46 120.65,8.89 122.99,8.89 122.99,12.83 126.8,12.83 U$6.MOSI | U$4.MOSI 82.5,13.46 | U$2.MOSI 38.2,13.46 | U$5.MOSI 106.5,13.46
  Bottom 0.203: U$3.MOSI 62.2,13.46 62.23,13.46
SPI1_SCK
  Top 0.203: R5.2 57.15,10.83 U$3.SCK
  Bottom 0.178: U$1.SCK 12.82,14.1 33.12,14.1 | 33.12,14.1 57.12,14.1 | 101.42,14.1 121.69,14.1 121.69,10.8 U$6.SCK | U$2.SCK 33.12,14.1 | U$3.SCK 57.12,14.1 | 77.42,14.1 U$4.SCK | U$5.SCK 101.42,14.1 | 101.42,14.1 101.42,22.23 85.6,22.23 85.6,14.1 77.42,14.1 | 57.12,14.1 64.26,14.1 64.26,15.24 77.42,15.24 77.42,14.1
SWCLK
  Top 0.203: JP3.4 60.71,8.1 60.25,8.56 54.25,8.56 53.37,9.45 53.37,12.9 55.37,14.91 55.37,24.89 54.81,25.45 IC1.37
SWDIO
  Top 0.203: IC1.34 51.93,8.47 55.07,5.33 JP3.2
TOUCH_SENSE
  Top 0.152: IC1.17 44.82,28.95 42.16,26.29 C18.2
TOUCH_SHIELD
  Top 0.152: 41.15,31.09 37.34,31.09 | 41.15,29.29 37.34,29.29
  Top 0.203: R12.2 41.15,33.02 | 41.15,33.02 41.15,31.09 41.15,29.29 | 41.15,33.02 37.77,33.02 37.31,32.56
  pour Top (isolate 0.279): 41.15,32.61 41.07,33.07 13.56,33.07 13.11,33.53 13.11,34.9 8.23,39.78 8.23,41.76 7.01,42.98 0.99,42.98 0.2,42.06 0.2,14.02 1.14,12.95 6.55,12.95 7.47,13.87 7.47,15.09 13.11,20.73 13.11,26.85 13.56,27.3 40.84,27.3 41.15,27.61
USART1_RX
  Top 0.203: 79.63,28.45 90.58,28.45 93.88,25.15 99.19,25.15 99.99,25.95 U$7.3_RXD | 79.63,28.45 IC1.43 | 100,28.36 U$7.3_RXD | U$7.3_RXD 99.99,29.89 100.33,30.23 103.38,30.23 106.55,27.05 106.55,14.15 105.23,12.83 105.23,5.23 JP4.4 | TP3.TP 79.63,28.45
USART1_TX
  Top 0.203: 83.69,27.95 90.24,27.95 93.55,24.64 100.08,24.64 101.09,25.65 U$7.2_TXD 101.09,29.59 101.22,29.72 103,29.72 105.28,27.43 105.28,15.27 102.67,12.65 102.67,5.21 JP4.2 102.69,5.23 | 83.69,27.95 IC1.42 | TP2.TP 83.82,27.95 83.69,27.95
USB_DM
  Top 0.203: IC1.32 50.93,8.13 49.35,6.55 X3.D-
USB_DP
  Top 0.203: IC1.33 51.43,7.87 50,6.44 X3.D+
VBAT  (via drill 0.5)
  Top 0.203: v96.65,30.23 96.65,28.41 U$7.6_V_BCKP | IC1.1 52.93,30.07 51.94,29.08 v51.94,27.81
  Bottom 0.203: v51.94,27.81 51.94,18.67 81.66,18.67 81.66,24.77 93.22,24.77 93.22,30.23 v96.65,30.23 102.62,30.23 104.01,28.83 G1.+

### Text on the board
tNames: GPS / FIX | - | 1 | 2 | 3 | 4 | 5 | 6 | RX | EXTINT | exixe clock / dekuNukem 2017 | * | TX | + | DIO | CLK | UP | DOWN | RX | TX | G | TP | DFU | RESET | TX | RX | G | 3V | G | 3V